# EAGLE schematic POE (EAGLE 6.4)
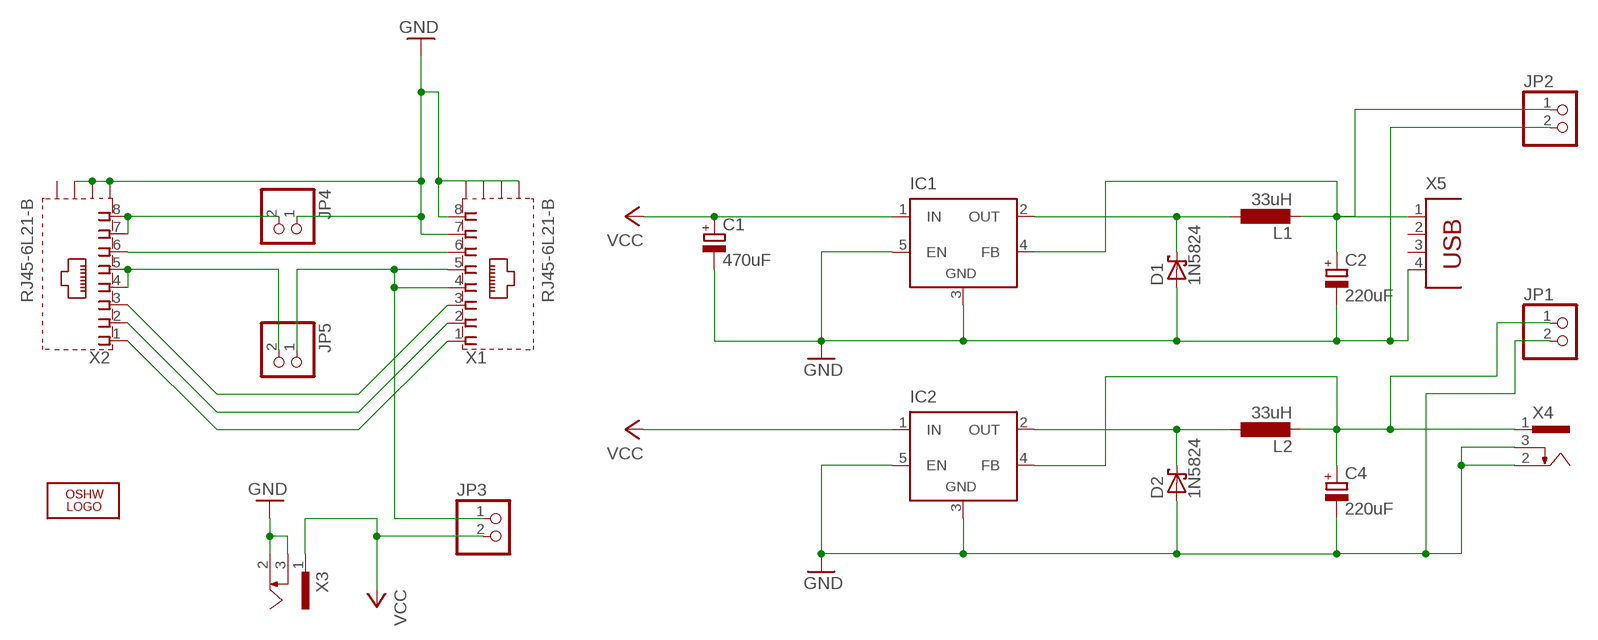
[diagram p0: schematic, sheet 1]

## Parts
C1  470uF  CPOL-EUE3.5-8  [E3,5-8]
C2  220uF  CPOL-EUE2.5-7  [E2,5-7]
C4  220uF  CPOL-EUE2.5-7  [E2,5-7]
D1  1N5824  BAT19  [DO35-10]
D2  1N5824  BAT19  [DO35-10]
IC1  LM2596TV  [TO220-51]
IC2  LM2596TV  [TO220-51]
JP1  PINHD-1X2  [1X02]
JP2  PINHD-1X2  [1X02]
JP3  PINHD-1X2  [1X02]
JP4  PINHD-1X2  [1X02]
JP5  PINHD-1X2  [1X02]
L1  33uH  L-EU6000-XXX-RC  [6000-XXXX-RC]
L2  33uH  L-EU6000-XXX-RC  [6000-XXXX-RC]
LOGO1  OSHW_LOGO_6MILX0200-NT  [OSHW_6X200_NOTEXT]
X1  RJ45-6L21-B  [RJ45-SHIELD1]
X2  RJ45-6L21-B  [RJ45-SHIELD1]
X3  733980-62  [733980-62]
X4  733980-62  [733980-62]
X5  PN87520  [PN87520]

## Nets
GND: C1.- C2.- C4.- D1.A D2.A IC1.3(GND) IC1.5(EN) IC2.3(GND) IC2.5(EN) JP1.2 JP2.2 JP4.1 X1.7 X1.8 X1.S1(S) X1.S2(S) X1.S4(S) X2.S1(S) X2.S2(S) X2.S3(S) X3.2 X3.3 X4.2 X4.3 X5.4
N$1: D1.C IC1.2(OUT) L1.1
N$2: C2.+ IC1.4(FB) JP2.1 L1.2 X5.1
N$3: X1.6 X2.6
N$4: D2.C IC2.2(OUT) L2.1
N$5: C4.+ IC2.4(FB) JP1.1 L2.2 X4.1
N$6: X1.3 X2.3
N$7: X1.2 X2.2
N$8: X1.1 X2.1
N$9: JP3.1 JP5.1 X1.4 X1.5
N$10: JP4.2 X2.7 X2.8
N$11: JP5.2 X2.4 X2.5
VCC: C1.+ IC1.1(IN) IC2.1(IN) JP3.2 X3.1
Unconnected: X1.S3(S) X2.S4(S) X5.2 X5.3

## Library data of the parts
C1 C2 C4 = rcl:CPOL-EU: POLARIZED CAPACITOR, European symbol
D1 D2 = diode:BAT19: DIODE barrier diode
IC1 IC2 = linear:LM2596T: STEP-DOWN VOLTAGE REGULATOR
JP1-JP5 = pinhead:PINHD-1X2: PIN HEADER
L1 L2 = rcl:L-EU: INDUCTOR, European symbol
LOGO1 = ohw-logo:OSHW_LOGO_6MIL
X1 X2 = con-tycoelectronics:RJ45*2: RJ45 Low Profile Shield Type 2 For all RJ45 L, LC, LCT and X Series Models Source: www.tycoelectronics.com .. ENG_DS_1654001_1099_RJ_L_0507.pdf; OC_FARNELL: unknown; OC_NEWARK: unknown
X3 X4 = con-conrad:73398?: FEMALE PRINT CONNECTOR Niedervolt-Steckverbinder Distributor Conrad
X5 = con-berg:PN87520: BERG USB connector; OC_FARNELL: unknown; OC_NEWARK: unknown